# Altium schematic sheet relays3.SchDoc
size A4
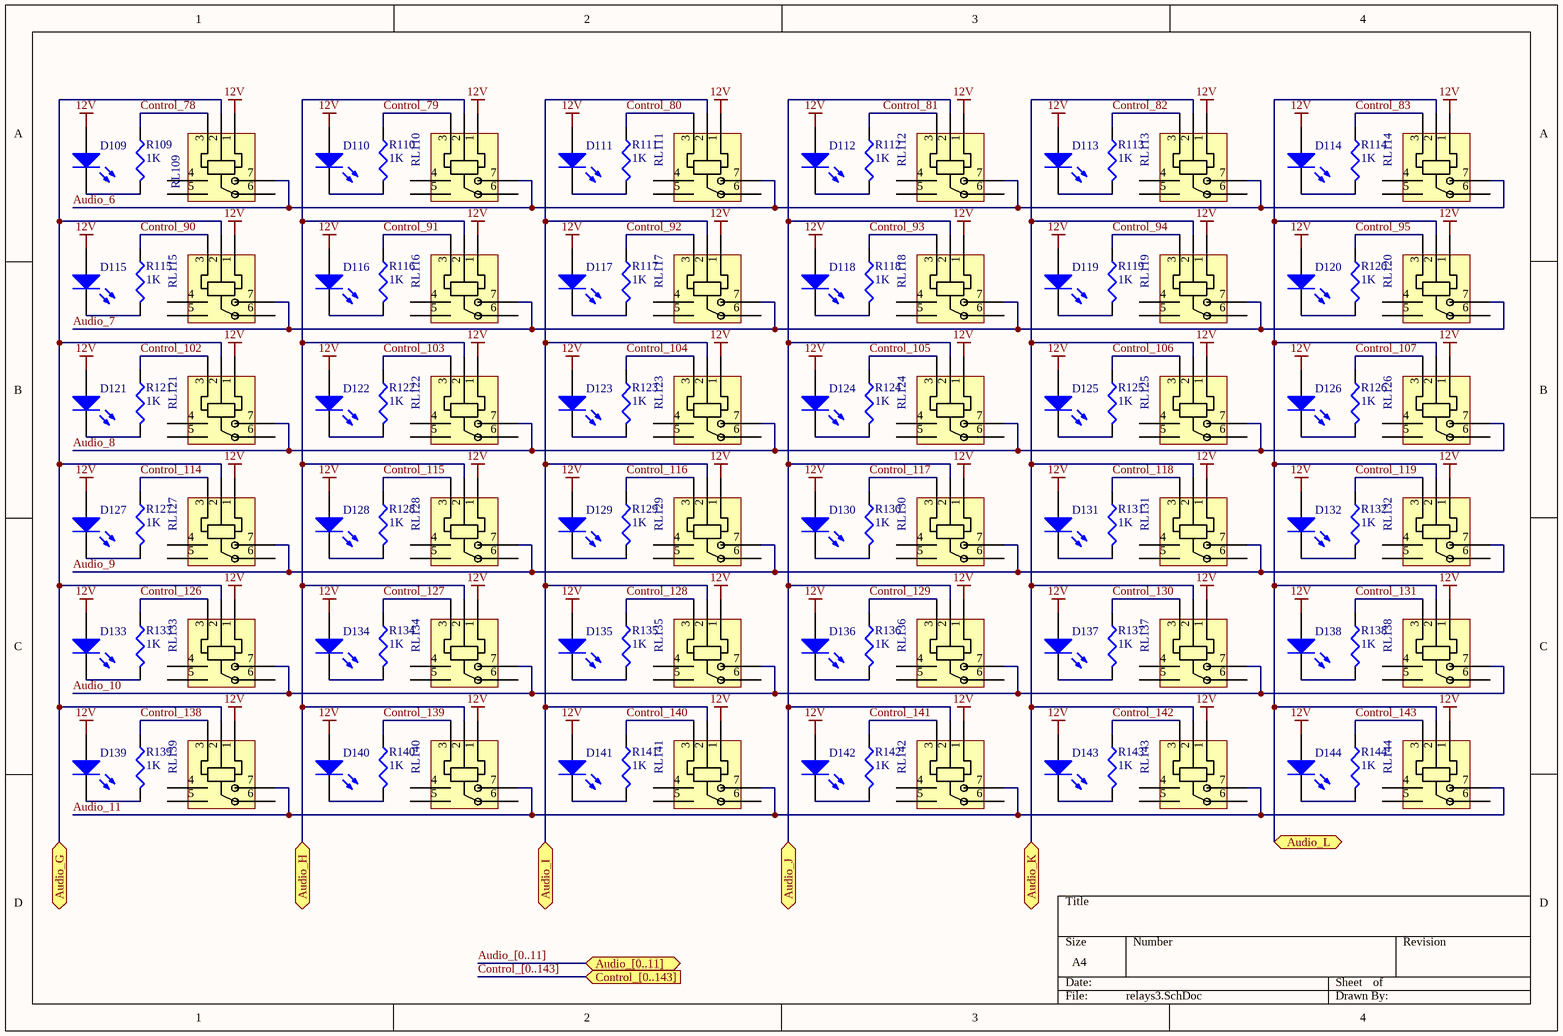
[diagram p0: relays3.SchDoc]

## Parts
D109  LED0  [LED_round_5mm]  (value not drawn)
D110  LED0  [LED_round_5mm]  (value not drawn)
D111  LED0  [LED_round_5mm]  (value not drawn)
D112  LED0  [LED_round_5mm]  (value not drawn)
D113  LED0  [LED_round_5mm]  (value not drawn)
D114  LED0  [LED_round_5mm]  (value not drawn)
D115  LED0  [LED_round_5mm]  (value not drawn)
D116  LED0  [LED_round_5mm]  (value not drawn)
D117  LED0  [LED_round_5mm]  (value not drawn)
D118  LED0  [LED_round_5mm]  (value not drawn)
D119  LED0  [LED_round_5mm]  (value not drawn)
D120  LED0  [LED_round_5mm]  (value not drawn)
D121  LED0  [LED_round_5mm]  (value not drawn)
D122  LED0  [LED_round_5mm]  (value not drawn)
D123  LED0  [LED_round_5mm]  (value not drawn)
D124  LED0  [LED_round_5mm]  (value not drawn)
D125  LED0  [LED_round_5mm]  (value not drawn)
D126  LED0  [LED_round_5mm]  (value not drawn)
D127  LED0  [LED_round_5mm]  (value not drawn)
D128  LED0  [LED_round_5mm]  (value not drawn)
D129  LED0  [LED_round_5mm]  (value not drawn)
D130  LED0  [LED_round_5mm]  (value not drawn)
D131  LED0  [LED_round_5mm]  (value not drawn)
D132  LED0  [LED_round_5mm]  (value not drawn)
D133  LED0  [LED_round_5mm]  (value not drawn)
D134  LED0  [LED_round_5mm]  (value not drawn)
D135  LED0  [LED_round_5mm]  (value not drawn)
D136  LED0  [LED_round_5mm]  (value not drawn)
D137  LED0  [LED_round_5mm]  (value not drawn)
D138  LED0  [LED_round_5mm]  (value not drawn)
D139  LED0  [LED_round_5mm]  (value not drawn)
D140  LED0  [LED_round_5mm]  (value not drawn)
D141  LED0  [LED_round_5mm]  (value not drawn)
D142  LED0  [LED_round_5mm]  (value not drawn)
D143  LED0  [LED_round_5mm]  (value not drawn)
D144  LED0  [LED_round_5mm]  (value not drawn)
R109  value 1K  [J1-0603]  (hidden comment: Res3)
R110  value 1K  [J1-0603]  (hidden comment: Res3)
R111  value 1K  [J1-0603]  (hidden comment: Res3)
R112  value 1K  [J1-0603]  (hidden comment: Res3)
R113  value 1K  [J1-0603]  (hidden comment: Res3)
R114  value 1K  [J1-0603]  (hidden comment: Res3)
R115  value 1K  [J1-0603]  (hidden comment: Res3)
R116  value 1K  [J1-0603]  (hidden comment: Res3)
R117  value 1K  [J1-0603]  (hidden comment: Res3)
R118  value 1K  [J1-0603]  (hidden comment: Res3)
R119  value 1K  [J1-0603]  (hidden comment: Res3)
R120  value 1K  [J1-0603]  (hidden comment: Res3)
R121  value 1K  [J1-0603]  (hidden comment: Res3)
R122  value 1K  [J1-0603]  (hidden comment: Res3)
R123  value 1K  [J1-0603]  (hidden comment: Res3)
R124  value 1K  [J1-0603]  (hidden comment: Res3)
R125  value 1K  [J1-0603]  (hidden comment: Res3)
R126  value 1K  [J1-0603]  (hidden comment: Res3)
R127  value 1K  [J1-0603]  (hidden comment: Res3)
R128  value 1K  [J1-0603]  (hidden comment: Res3)
R129  value 1K  [J1-0603]  (hidden comment: Res3)
R130  value 1K  [J1-0603]  (hidden comment: Res3)
R131  value 1K  [J1-0603]  (hidden comment: Res3)
R132  value 1K  [J1-0603]  (hidden comment: Res3)
R133  value 1K  [J1-0603]  (hidden comment: Res3)
R134  value 1K  [J1-0603]  (hidden comment: Res3)
R135  value 1K  [J1-0603]  (hidden comment: Res3)
R136  value 1K  [J1-0603]  (hidden comment: Res3)
R137  value 1K  [J1-0603]  (hidden comment: Res3)
R138  value 1K  [J1-0603]  (hidden comment: Res3)
R139  value 1K  [J1-0603]  (hidden comment: Res3)
R140  value 1K  [J1-0603]  (hidden comment: Res3)
R141  value 1K  [J1-0603]  (hidden comment: Res3)
R142  value 1K  [J1-0603]  (hidden comment: Res3)
R143  value 1K  [J1-0603]  (hidden comment: Res3)
R144  value 1K  [J1-0603]  (hidden comment: Res3)
RL109  Relay  [Relay_FRA3]  (value not drawn)
RL110  Relay  [Relay_FRA3]  (value not drawn)
RL111  Relay  [Relay_FRA3]  (value not drawn)
RL112  Relay  [Relay_FRA3]  (value not drawn)
RL113  Relay  [Relay_FRA3]  (value not drawn)
RL114  Relay  [Relay_FRA3]  (value not drawn)
RL115  Relay  [Relay_FRA3]  (value not drawn)
RL116  Relay  [Relay_FRA3]  (value not drawn)
RL117  Relay  [Relay_FRA3]  (value not drawn)
RL118  Relay  [Relay_FRA3]  (value not drawn)
RL119  Relay  [Relay_FRA3]  (value not drawn)
RL120  Relay  [Relay_FRA3]  (value not drawn)
RL121  Relay  [Relay_FRA3]  (value not drawn)
RL122  Relay  [Relay_FRA3]  (value not drawn)
RL123  Relay  [Relay_FRA3]  (value not drawn)
RL124  Relay  [Relay_FRA3]  (value not drawn)
RL125  Relay  [Relay_FRA3]  (value not drawn)
RL126  Relay  [Relay_FRA3]  (value not drawn)
RL127  Relay  [Relay_FRA3]  (value not drawn)
RL128  Relay  [Relay_FRA3]  (value not drawn)
RL129  Relay  [Relay_FRA3]  (value not drawn)
RL130  Relay  [Relay_FRA3]  (value not drawn)
RL131  Relay  [Relay_FRA3]  (value not drawn)
RL132  Relay  [Relay_FRA3]  (value not drawn)
RL133  Relay  [Relay_FRA3]  (value not drawn)
RL134  Relay  [Relay_FRA3]  (value not drawn)
RL135  Relay  [Relay_FRA3]  (value not drawn)
RL136  Relay  [Relay_FRA3]  (value not drawn)
RL137  Relay  [Relay_FRA3]  (value not drawn)
RL138  Relay  [Relay_FRA3]  (value not drawn)
RL139  Relay  [Relay_FRA3]  (value not drawn)
RL140  Relay  [Relay_FRA3]  (value not drawn)
RL141  Relay  [Relay_FRA3]  (value not drawn)
RL142  Relay  [Relay_FRA3]  (value not drawn)
RL143  Relay  [Relay_FRA3]  (value not drawn)
RL144  Relay  [Relay_FRA3]  (value not drawn)

## Ports
Audio_[0..11] (bidir), Audio_G (bidir), Audio_H (bidir), Audio_I (bidir), Audio_J (bidir), Audio_K (bidir), Audio_L (bidir), Control_[0..143] (in)

## Nets
12V: D109.1(A) D110.1(A) D111.1(A) D112.1(A) D113.1(A) D114.1(A) D115.1(A) D116.1(A) D117.1(A) D118.1(A) D119.1(A) D120.1(A) D121.1(A) D122.1(A) D123.1(A) D124.1(A) D125.1(A) D126.1(A) D127.1(A) D128.1(A) D129.1(A) D130.1(A) D131.1(A) D132.1(A) D133.1(A) D134.1(A) D135.1(A) D136.1(A) D137.1(A) D138.1(A) D139.1(A) D140.1(A) D141.1(A) D142.1(A) D143.1(A) D144.1(A) RL109.1 RL110.1 RL111.1 RL112.1 RL113.1 RL114.1 RL115.1 RL116.1 RL117.1 RL118.1 RL119.1 RL120.1 RL121.1 RL122.1 RL123.1 RL124.1 RL125.1 RL126.1 RL127.1 RL128.1 RL129.1 RL130.1 RL131.1 RL132.1 RL133.1 RL134.1 RL135.1 RL136.1 RL137.1 RL138.1 RL139.1 RL140.1 RL141.1 RL142.1 RL143.1 RL144.1
Audio_6: RL109.7 RL110.7 RL111.7 RL112.7 RL113.7 RL114.7
Audio_7: RL115.7 RL116.7 RL117.7 RL118.7 RL119.7 RL120.7
Audio_8: RL121.7 RL122.7 RL123.7 RL124.7 RL125.7 RL126.7
Audio_9: RL127.7 RL128.7 RL129.7 RL130.7 RL131.7 RL132.7
Audio_10: RL133.7 RL134.7 RL135.7 RL136.7 RL137.7 RL138.7
Audio_11: RL139.7 RL140.7 RL141.7 RL142.7 RL143.7 RL144.7
Audio_G: RL109.2 RL115.2 RL121.2 RL127.2 RL133.2 RL139.2 ; port Audio_G
Audio_H: RL110.2 RL116.2 RL122.2 RL128.2 RL134.2 RL140.2 ; port Audio_H
Audio_I: RL111.2 RL117.2 RL123.2 RL129.2 RL135.2 RL141.2 ; port Audio_I
Audio_J: RL112.2 RL118.2 RL124.2 RL130.2 RL136.2 RL142.2 ; port Audio_J
Audio_K: RL113.2 RL119.2 RL125.2 RL131.2 RL137.2 RL143.2 ; port Audio_K
Audio_L: RL114.2 RL120.2 RL126.2 RL132.2 RL138.2 RL144.2 ; port Audio_L
Control_78: R109.1 RL109.3
Control_79: R110.1 RL110.3
Control_80: R111.1 RL111.3
Control_81: R112.1 RL112.3
Control_82: R113.1 RL113.3
Control_83: R114.1 RL114.3
Control_90: R115.1 RL115.3
Control_91: R116.1 RL116.3
Control_92: R117.1 RL117.3
Control_93: R118.1 RL118.3
Control_94: R119.1 RL119.3
Control_95: R120.1 RL120.3
Control_102: R121.1 RL121.3
Control_103: R122.1 RL122.3
Control_104: R123.1 RL123.3
Control_105: R124.1 RL124.3
Control_106: R125.1 RL125.3
Control_107: R126.1 RL126.3
Control_114: R127.1 RL127.3
Control_115: R128.1 RL128.3
Control_116: R129.1 RL129.3
Control_117: R130.1 RL130.3
Control_118: R131.1 RL131.3
Control_119: R132.1 RL132.3
Control_126: R133.1 RL133.3
Control_127: R134.1 RL134.3
Control_128: R135.1 RL135.3
Control_129: R136.1 RL136.3
Control_130: R137.1 RL137.3
Control_131: R138.1 RL138.3
Control_138: R139.1 RL139.3
Control_139: R140.1 RL140.3
Control_140: R141.1 RL141.3
Control_141: R142.1 RL142.3
Control_142: R143.1 RL143.3
Control_143: R144.1 RL144.3
NetD109_2: D109.2(K) R109.2
NetD110_2: D110.2(K) R110.2
NetD111_2: D111.2(K) R111.2
NetD112_2: D112.2(K) R112.2
NetD113_2: D113.2(K) R113.2
NetD114_2: D114.2(K) R114.2
NetD115_2: D115.2(K) R115.2
NetD116_2: D116.2(K) R116.2
NetD117_2: D117.2(K) R117.2
NetD118_2: D118.2(K) R118.2
NetD119_2: D119.2(K) R119.2
NetD120_2: D120.2(K) R120.2
NetD121_2: D121.2(K) R121.2
NetD122_2: D122.2(K) R122.2
NetD123_2: D123.2(K) R123.2
NetD124_2: D124.2(K) R124.2
NetD125_2: D125.2(K) R125.2
NetD126_2: D126.2(K) R126.2
NetD127_2: D127.2(K) R127.2
NetD128_2: D128.2(K) R128.2
NetD129_2: D129.2(K) R129.2
NetD130_2: D130.2(K) R130.2
NetD131_2: D131.2(K) R131.2
NetD132_2: D132.2(K) R132.2
NetD133_2: D133.2(K) R133.2
NetD134_2: D134.2(K) R134.2
NetD135_2: D135.2(K) R135.2
NetD136_2: D136.2(K) R136.2
NetD137_2: D137.2(K) R137.2
NetD138_2: D138.2(K) R138.2
NetD139_2: D139.2(K) R139.2
NetD140_2: D140.2(K) R140.2
NetD141_2: D141.2(K) R141.2
NetD142_2: D142.2(K) R142.2
NetD143_2: D143.2(K) R143.2
NetD144_2: D144.2(K) R144.2

Not connected (* = marked no-connect by the designer): RL109 4 5 6; RL110 4 5 6; RL111 4 5 6; RL112 4 5 6; RL113 4 5 6; RL114 4 5 6; RL115 4 5 6; RL116 4 5 6; RL117 4 5 6; RL118 4 5 6; RL119 4 5 6; RL120 4 5 6; RL121 4 5 6; RL122 4 5 6; RL123 4 5 6; RL124 4 5 6; RL125 4 5 6; RL126 4 5 6; RL127 4 5 6; RL128 4 5 6; RL129 4 5 6; RL130 4 5 6; RL131 4 5 6; RL132 4 5 6; RL133 4 5 6; RL134 4 5 6; RL135 4 5 6; RL136 4 5 6; RL137 4 5 6; RL138 4 5 6; RL139 4 5 6; RL140 4 5 6; RL141 4 5 6; RL142 4 5 6; RL143 4 5 6; RL144 4 5 6

## Buses and harness runs
bus Audio_[0..11] = port Audio_[0..11]
bus Control_[0..143] = port Control_[0..143]

## Library data of the parts
D109-D144 = LED0: Typical INFRARED GaAs LED; Published: 8-Jun-2000; LatestRevisionDate: 08-Jul-2005; LatestRevisionNote: Mech Layer 1 removed.; PackageReference: LED-0; Publisher: Altium Limited; PackageDescription: LED; 2 Leads
R109-R144 = Res3: Resistor; Published: 8-Jun-2000; LatestRevisionDate: 29-May-2009; LatestRevisionNote: IPC-7351 Footprint Added.; PackageReference: J1-0603; Publisher: Altium Limited; PackageDescription: Chip Resistor
RL109-RL144 = Relay_FRA3: Miniature power relay; Part number: FRA3C-DC12